# EasyEDA Pro project ProPrj_ESP32辉光钟_2025-08-24.epro, board PCB2_0
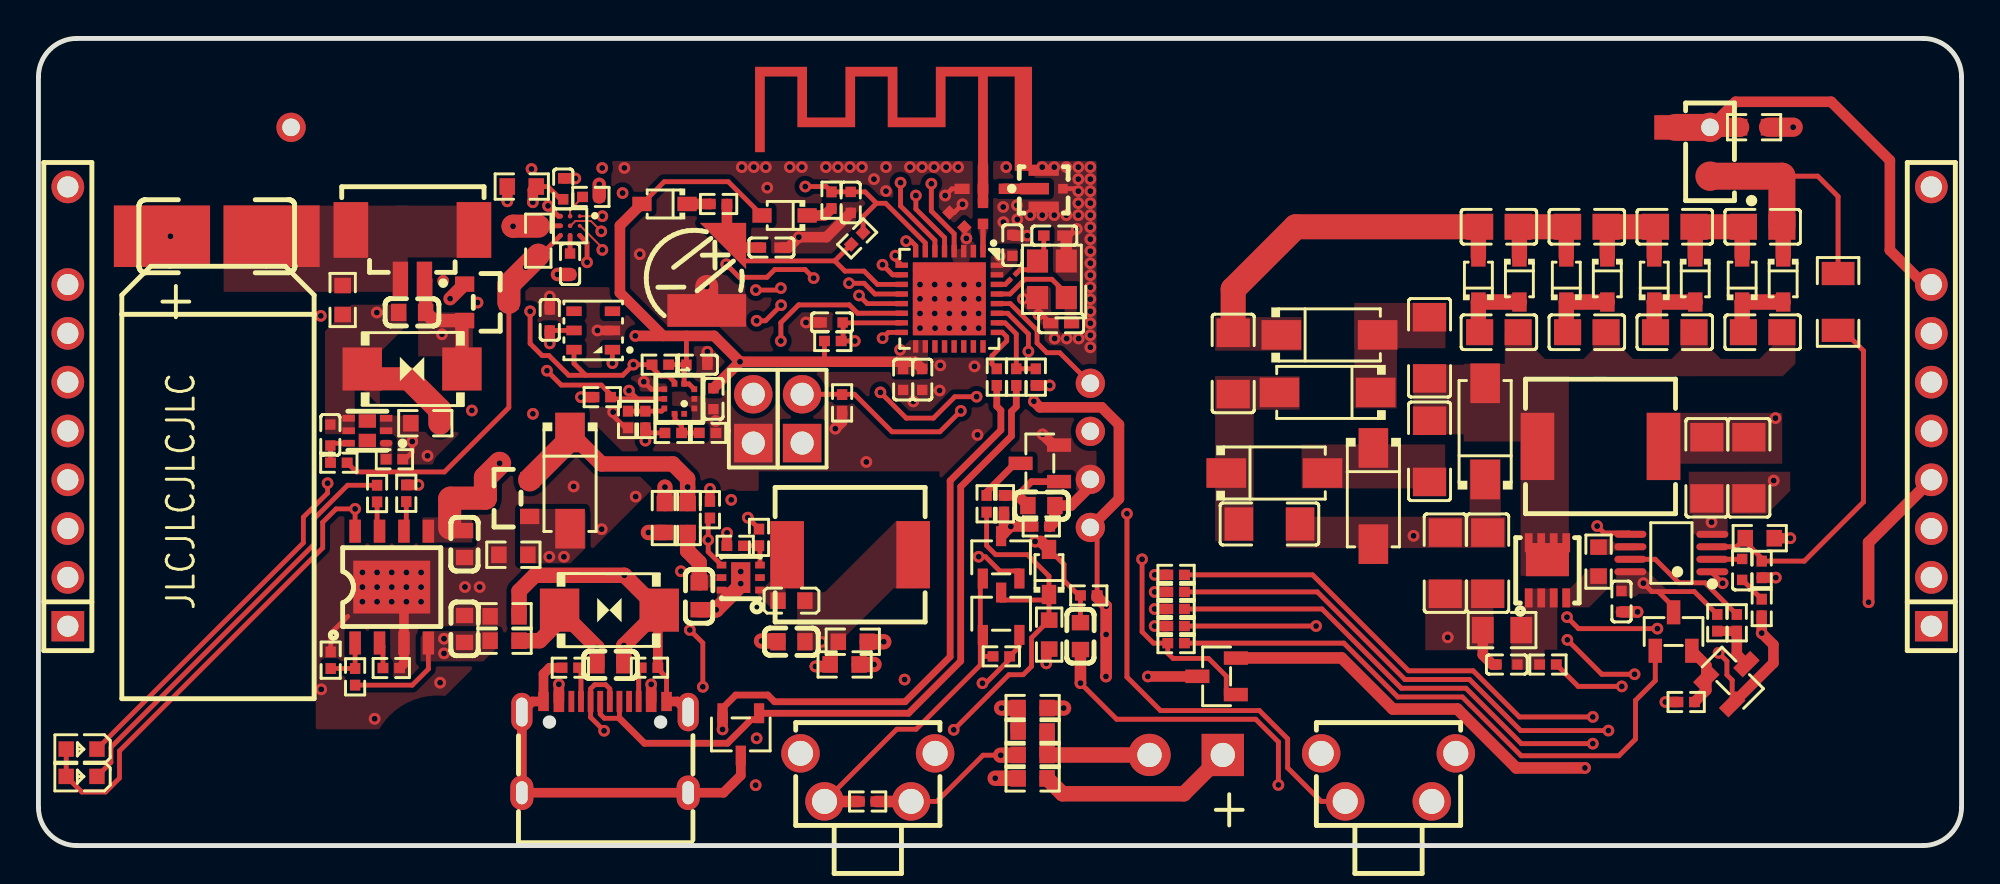
[diagram p6: board, top side]
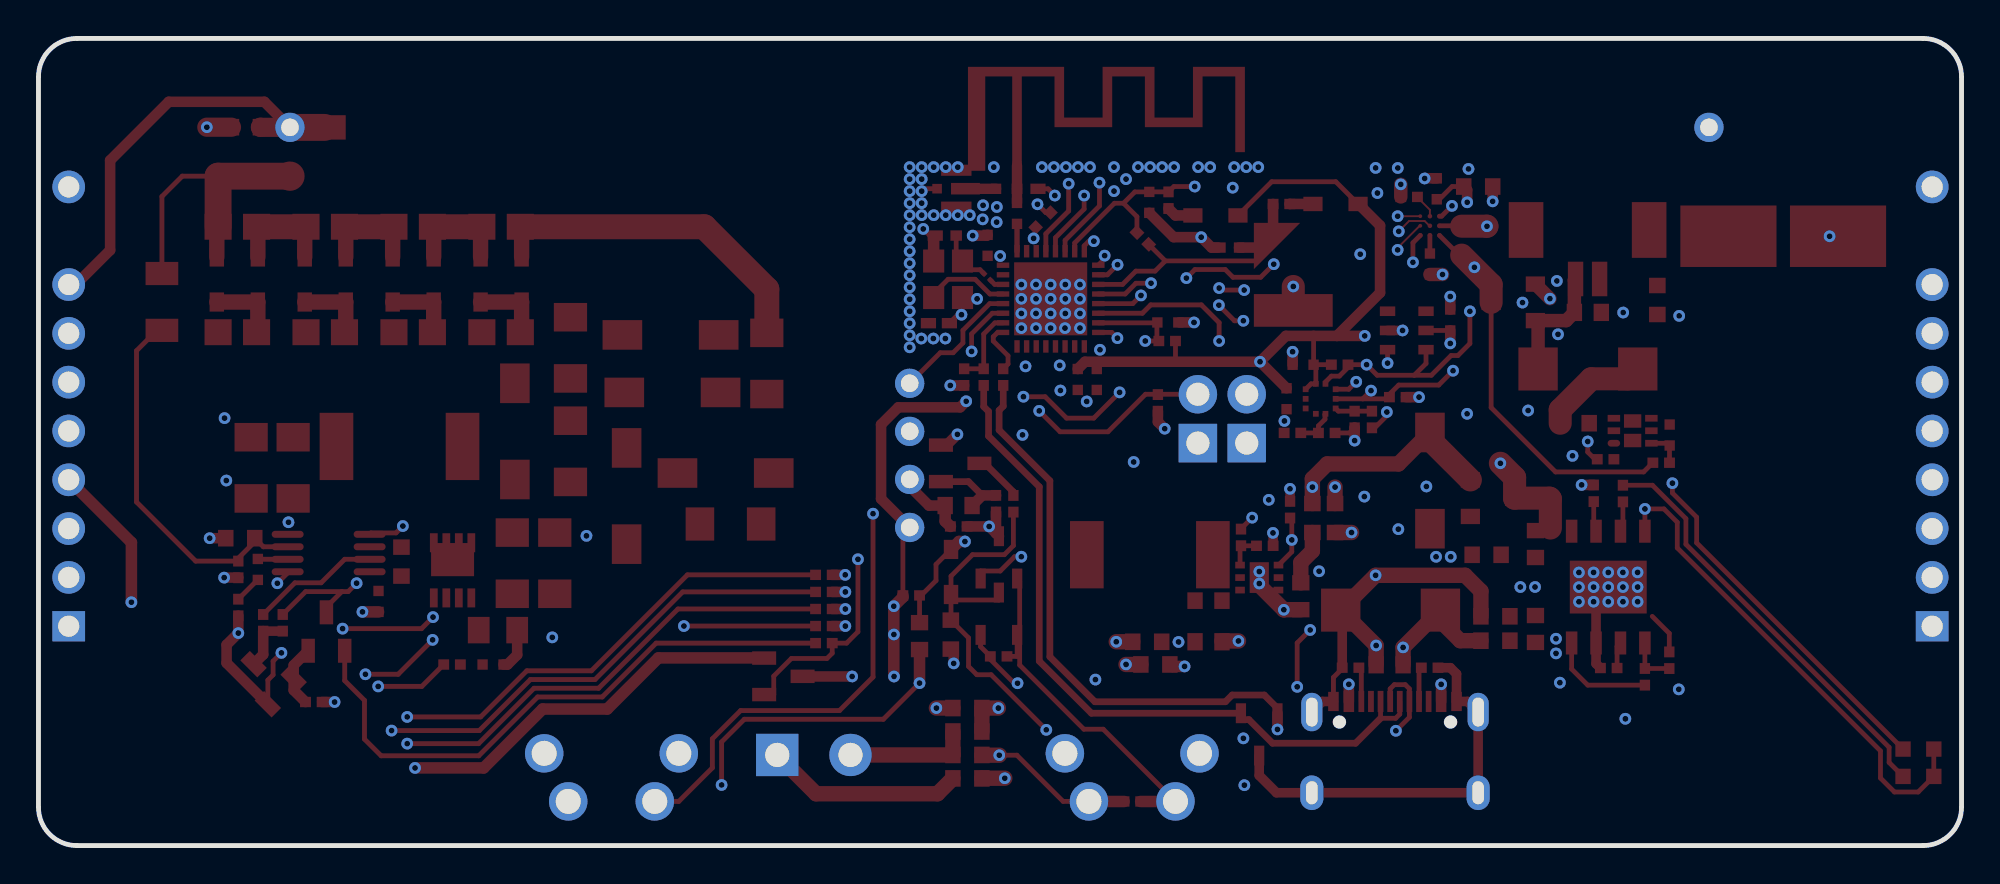
[diagram p7: board, bottom side, seen from below]

Outline 100 x 42 mm; copper layers: Top Layer, Inner1, Inner2, Bottom Layer. Coordinates in mm from the lower left corner of the outline.
Outline path: 0,40 0,2 arc(0.59,0.59) 2,0 98,0 arc(99.41,0.59) 100,2 100,40 arc(99.41,41.41) 98,42 2,42 arc(0.59,41.41) 0,40
Stack: Top Layer 0.035mm 外层铜厚1oz / Dielectric1 0.2104mm 7628 RC49% 8.6mil / Inner1 0.0152mm 内层铜厚 / Dielectric2 1.065mm 1.1mm H/HOZ Copper / Inner2 0.0152mm 内层铜厚 / Dielectric3 0.2104mm 7628 RC49% 8.6mil / Bottom Layer 0.035mm 外层铜厚1oz

## Design rules (mm)
template: 自定义配置1
spacing Default (default): track to track 0.2, other pairs 0 to 0.5
spacing dis+170v: track to track 1, other pairs 0 to 1.001
spacing dis+3v3: track to track 0.2, other pairs 0.152 to 0.3
spacing usbtypec: track to track 0.2, other pairs 0.152 to 0.3
spacing safeBGA: track to track 0.1, other pairs 0.1 to 0.3
track width Default (default): min 0.249, default 0.249, max 25.4
track width dis+170v: min 0.249, default 0.249, max 25.4
track width trackbga: min 0.1, default 0.254, max 2.54
differential pair differentialPair (default): width min 0.127, default 0.254, max 2.54; gap min 0.152, default 0.152
via Default (default): diameter min 0.61, default 0.61, max 100.025; hole min 0.305, default 0.305, max 59.995
via dis+170v: diameter min 0.61, default 0.61, max 100.025; hole min 0.305, default 0.305, max 59.995
net SDA uses safeBGA, trackbga
net GNDBADC uses safeBGA, trackbga
net BATALT uses safeBGA, trackbga
net $7N48606 uses trackbga

## Placement (name value [footprint] x y rotation side)
C1  10uF  [C0603]  19.43 27.74 0 top
C2  10uF  [C0603]  22.16 15.69 90 top
C3  10uF  [C0603]  22.16 11.27 270 top
C7  22nF  [C0402#2]  88.59 14.37 90 top
C13  4.7uF  [C1206]  72.34 20.52 270 top
C15  22uF  [C1206]  73.15 14.7 90 top
C16  4.7uF  [C1206]  64.01 16.73 180 top
C17  4.7uF  [C1206]  62.13 25.09 90 top
C18  4.7uF  [C1206]  72.34 25.9 90 top
C19  2.2uF  [C0805]  75.94 32.2 0 top
C20  2.2uF  [C0805]  75.94 26.71 180 top
C21  2.2uF  [C0805]  89.66 32.2 0 top
C22  2.2uF  [C0805]  89.66 26.71 180 top
C23  2.2uF  [C0805]  85.09 32.2 0 top
C24  2.2uF  [C0805]  85.09 26.71 180 top
C25  2.2uF  [C0805]  80.52 32.2 0 top
C26  2.2uF  [C0805]  80.52 26.71 180 top
C54  NULL  [C0402#3]  48.57 34.17 0 top
C56  10nF  [C0402#2]  42.24 33.47 90 top
C59  10uF  [C0402#2]  50.64 31.23 270 top
C61  10uF  [C0402#3]  38.11 31.12 180 top
C66  10uF  [C0402#2]  44.97 24.25 90 top
C68  10uF  [C0402#2]  47.76 32.56 315 top
C70  10uF  [C0402#2]  45.96 24.25 90 top
C71  10pF  [C0402]  52.82 31.74 180 top
C72  10pF  [C0402#4]  53.18 27.18 0 top
C73  10nF  [C0402#2]  41.27 27.22 0 top
C74  10uF  [C0603]  29.74 9.41 180 top
C75  10uF  [C0603]  54.18 10.9 90 top
C76  22uF  [C1206]  75.36 14.7 90 top
C77  22uF  [C1206]  88.94 19.66 90 top
C78  22uF  [C1206]  86.76 19.66 90 top
C82  100nF  [C0402#2]  76.36 9.42 0 top
C83  NULL  [C0402#2]  49.66 34.17 0 top
C84  1nF  [C2211]  9.27 31.71 180 top
C150  10uF  [C0603]  34.36 12.97 90 top
C151  10uF  [C0603]  39.16 10.6 0 top
C158  10uF  [C0402#2]  26.59 27.35 270 top
C160  10uF  [C0402#2]  34.24 25.02 180 top
C161  100nF  [C0402#2]  35.1 23.25 90 top
C163  10uF  [C0402#2]  82.32 12.7 90 top
C165  100nF  [C0402#2]  15.18 21.36 270 top
C166  100nF  [C0402#2]  27.64 30.26 90 top
C168  10uF  [C0603]  52.15 17.69 180 top
C169  2.2uF  [C0402#2]  27.29 34.18 90 top
CN2  DZ254S-11-02-48  [HDR-SMD_2P-P2.54_XKB_X6511WVS-02H-C60D48R2]  86.92 36.1 90 top
D1  P6SMB6.8CA/TR13  [SMB_L4.6-W3.6-LS5.3-BI]  19.43 24.8 0 top
D2  1N4148WS  [SOD-323_L1.8-W1.3-LS2.5-RD]  52.55 14.24 90 top
D16  PSM712-LF-T7  [SOT-23-3_L3.0-W1.7-P0.95-LS2.9-BR]  36.52 5.78 90 top
D17  P6SMB6.8CA/TR13  [SMB_L4.6-W3.6-LS5.3-BI]  29.69 12.25 180 top
D18  SS54  [SMA_L4.4-W2.8-LS5.4-R-RD]  69.42 18.19 270 top
D19  SS54  [SMA_L4.4-W2.8-LS5.4-R-RD]  64.27 19.39 0 top
D20  SS54  [SMA_L4.4-W2.8-LS5.4-R-RD]  67.13 26.57 0 top
D21  SS54  [SMA_L4.4-W2.8-LS5.4-R-RD]  67.03 23.58 180 top
D22  1N5819WS  [SOD-323_L1.8-W1.3-LS2.5-RD]  74.88 29.46 90 top
D23  1N5819WS  [SOD-323_L1.8-W1.3-LS2.5-RD]  88.59 29.46 90 top
D24  1N5819WS  [SOD-323_L1.8-W1.3-LS2.5-RD]  84.02 29.46 90 top
D25  1N5819WS  [SOD-323_L1.8-W1.3-LS2.5-RD]  79.45 29.46 90 top
D26  1N5819WS  [SOD-323_L1.8-W1.3-LS2.5-RD]  81.58 29.46 270 top
D27  1N5819WS  [SOD-323_L1.8-W1.3-LS2.5-RD]  86.15 29.46 270 top
D28  1N5819WS  [SOD-323_L1.8-W1.3-LS2.5-RD]  90.73 29.46 270 top
D29  1N5819WS  [SOD-323_L1.8-W1.3-LS2.5-RD]  77.01 29.46 270 top
D30  SS54  [SMA_L4.4-W2.8-LS5.4-R-RD]  75.23 21.55 90 top
D33  SS54  [SMA_L4.4-W2.8-LS5.4-R-RD]  27.64 18.99 270 top
D34  1N4148WS  [SOD-323_L1.8-W1.3-LS2.5-RD]  32.55 33.39 180 top
D35  1N4148WS  [SOD-323_L1.8-W1.3-LS2.5-RD]  38.8 32.79 180 top
F1  0Ω  [R0603]  15.82 28.39 270 top
FPC1  1.25-2PWB  [CONN-SMD_2P-P1.25_DEALON_1.25-2PWB]  19.45 30.76 180 top
H1  PZ254V-11-02P  [HDR-TH_2P-P2.54-V-M]  39.71 22.21 90 top
H2  PZ254V-11-02P  [HDR-TH_2P-P2.54-V-M]  37.17 22.21 90 top
J1  2.54-1*10P针  [HDR-TH_10P-P2.54-V-M-1]  98.43 22.84 90 top
J2  2.54-1*10P针  [HDR-TH_10P-P2.54-V-M-1]  1.53 22.84 90 top
KEY5  TS665ZJ  [SW-TH_TS665ZJ]  70.2 3.55 0 top
KEY7  TS665ZJ  [SW-TH_TS665ZJ]  43.13 3.55 0 top
L1  22uH  [IND-SMD_L7.8-W7.0_FXC0630]  42.21 15.13 0 top
L2  22uH  [IND-SMD_L7.8-W7.0_FXC0630]  81.23 20.77 180 top
L15  0R  [L0402]  49.12 32.9 270 top
L19  2.2uH  [L0603]  39.16 12.74 0 top
LED1  A-SP192GW1D-D01-4T  [LED0603-RD]  2.24 5.02 180 top
LED2  KT-0603R  [LED0603-RD]  2.24 3.6 180 top
NOREF  -  [Pad_e511]  54.7 21.55 270 top
NOREF#2  -  [Pad_e3337]  86.92 34.83 180 top
NOREF#3  -  [Pad_e3336]  86.92 37.37 270 top
NOREF#4  -  [Pad_e3335]  13.14 37.37 270 top
NOREF#5  -  [Pad_e24]  61.58 4.72 180 top
NOREF#6  -  [Pad_e534]  54.7 19.05 270 top
NOREF#7  -  [Pad_e510]  54.7 24.05 270 top
NOREF#8  -  [Pad_e1713]  54.7 16.55 270 top
NOREF#9  -  [Pad_e28]  57.77 4.72 180 top
Q1  SI2301CDS-T1-GE3  [SOT-23-3_L3.0-W1.7-P0.95-LS2.9-BR]  50.06 12.06 270 top
Q2  SI2301CDS-T1-GE3  [SOT-23-3_L3.0-W1.7-P0.95-LS2.9-BR]  50.06 15 270 top
Q9  SQ7414CENW-T1_GE3  [POWERPAK-1212-8_L3.3-W3.3-P0.65-BL-EP]  78.47 14.32 0 top
Q11  AO3401A  [SOT-23_L2.9-W1.3-P1.90-LS2.4-BR]  24.39 18.08 0 top
Q12  AO3401A  [SOT-23_L2.9-W1.3-P1.90-LS2.4-BR]  23.31 28.27 180 top
Q13  AO3400A  [SOT-23-3_L2.9-W1.3-P1.90-LS2.4-BR]  61.26 8.81 0 top
Q14  2N7002  [SOT-23-3_L2.9-W1.3-P1.90-LS2.4-BR]  85.03 11.14 270 top
Q15  AO3400A  [SOT-23-3_L2.9-W1.3-P1.90-LS2.4-BR]  88.11 8.73 225 top
Q16  2N7002  [SOT-23-3_L2.9-W1.3-P1.90-LS2.4-BR]  52.07 19.89 0 top
R2  5.1kΩ  [R0402]  27.66 9.26 0 top
R3  10kΩ  [R0402]  16.47 8.78 270 top
R4  10kΩ  [R0402]  15.2 9.64 270 top
R5  1kΩ  [R0402]  19.13 18.33 270 top
R6  1kΩ  [R0402]  17.61 18.32 270 top
R7  1kΩ  [R0402]  18.35 9.24 180 top
R14  100kΩ  [R0402]  50.07 9.84 0 top
R15  100kΩ  [R0402]  52.15 16.61 180 top
R16  10MΩ  [R0603]  52.56 10.98 90 top
R17  1MΩ  [R0402]  54.62 13.02 0 top
R18  0Ω  [R0603]  81.12 14.78 270 top
R19  51kΩ  [R0402]  88.31 11.59 90 top
R20  0Ω  [R0805]  76.11 11.21 0 top
R21  4.7kΩ  [R0402]  89.61 12.39 90 top
R23  1MΩ  [R1206]  93.58 28.29 90 top
R24  7.5kΩ  [R0603]  89.51 15.99 180 top
R25  NULL  [R0402]  89.61 14.37 270 top
R29  10kΩ  [R0402]  87.3 11.59 90 top
R40  0Ω  [R0402]  50.85 24.38 90 top
R41  0Ω  [R0402]  49.83 24.38 90 top
R42  100KΩ  [R0402]  51.86 24.38 90 top
R45  100KΩ  [R0402]  41.31 26.26 0 top
R56  5.1kΩ  [R0402]  31.77 9.26 180 top
R57  0Ω  [R0603]  51.7 5.94 180 top
R59  0Ω  [R0603]  51.7 4.72 0 top
R60  0Ω  [R0603]  32.58 17.04 270 top
R61  0Ω  [R0603]  24.24 11.93 180 top
R63  0Ω  [R0402]  78.49 9.42 0 top
R128  200kΩ  [R0402]  37.47 16.03 270 top
R129  100kΩ  [R0402]  36.23 15.6 180 top
R145  10kΩ  [R0603]  24.7 15.13 180 top
R146  0Ω  [R0603]  33.76 17.04 270 top
R147  0Ω  [R0603]  24.24 10.66 180 top
R148  0Ω  [R0603]  51.7 3.5 0 top
R149  100KΩ  [R0402]  41.24 33.58 90 top
R151  0Ω  [R0603]  51.7 7.16 180 top
R152  0Ω  [R0603]  89.21 37.38 180 top
R153  0Ω  [R0402]  59.16 12.31 180 top
R154  0Ω  [R0402]  59.16 13.2 180 top
R155  0Ω  [R0402]  59.16 14.09 180 top
R157  100KΩ  [R0402]  41.79 23.04 270 top
R159  0Ω  [R0201]  50.67 29.59 45 top
R160  0Ω  [R0603]  41.92 9.42 0 top
R161  0Ω  [R0603]  42.34 10.6 0 top
R164  2kΩ  [R0402]  29.32 23.33 180 top
R165  2kΩ  [R0402]  32.34 25.02 180 top
R169  NULL  [R0402]  33.01 21.47 0 top
R170  NULL  [R0402]  34.79 21.47 0 top
R171  NULL  [R0402]  31.56 22.17 90 top
R172  1kΩ  [R0402]  30.66 22.17 270 top
R173  0Ω  [R0402]  59.16 11.42 180 top
R174  0Ω  [R0402]  59.16 10.53 0 top
R176  NULL  [R0402]  43.12 2.29 0 top
R178  470Ω  [R0402]  15.62 19.92 180 top
R179  2kΩ  [R0402]  18.51 20.1 180 top
R181  0Ω  [R0402]  34.92 17.48 270 top
R182  0Ω  [R0603]  20.12 21.98 180 top
R183  10kΩ  [R0402]  28.73 33.75 180 top
R184  10mΩ  [R0603]  25.99 31.48 90 top
R186  0Ω  [R0402]  49.3 17.79 270 top
R187  1MΩ  [R0402]  50.21 17.79 270 top
R188  100kΩ  [R0402]  85.68 7.47 0 top
R189  0Ω  [R0603]  25.13 34.29 0 top
R190  1kΩ  [R0402]  35.37 33.39 0 top
R191  100KΩ  [R0402]  42.57 31.59 225 top
RF2  BWIPX-4-001E  [IPEX-SMD_BWIPX-4-001E]  52.53 34.18 270 top
S1  AHT20  [SENSOR-SMD_L3.0-W3.0-P1.00-BR]  28.85 26.8 0 top
U2  TP4056-42-ESOP8  [ESOP-8_L4.9-W3.9-P1.27-LS6.0-BL-EP]  18.37 13.45 0 top
U5  LM3478MMX/NOPB  [VSSOP-8_L3.0-W3.0-P0.65-LS5.0-BL]  84.91 15.22 90 top
U16  ESP32-C3FH4  [QFN-32_L5.0-W5.0-P0.50-TL-EP3.7]  47.37 28.45 270 top
U17  ML414H-IV01E  [BAT-SMD_ML414H-IV01E]  35.17 29.82 0 top
U22  -  [2.4G天线]  51.67 35.12 0 top
U23  BMP580  [LGA-10_L2.0-W2.0-P0.50-TL_BMP580]  33.33 23.25 270 top
U46  ETA3425D2G  [TDFN-6_L2.0-W2.0-P0.65-TL-EP]  36.52 13.94 180 top
U47  SL197-1  [DFN-6L_L2.0-W2.0-P0.65-BL_SL197-1]  17.1 21.59 90 top
U48  BQ27220YZFR  [DSBGA-9_L1.7-W1.6-R3-C3-P0.50-BL]  27.65 32.25 180 top
USB1  TYPE-C 16PIN 2MD(073)  [USB-C-SMD_TYPE-C-6PIN-2MD-073]  29.46 5.12 0 top
X4  40MHz  [CRYSTAL-SMD_4P-L2.5-W2.0-BL]  52.7 29.47 90 top

## Footprints (pads in the part's own frame, mm; a bottom-side part is the same pattern mirrored in y, then rotated)
2.4G天线
  rect 0.85x0.5 smd: 1(-0.447,0.254)
  rect 0.45x0.5 smd: 2(-2.55,0.254)
BAT-SMD_ML414H-IV01E
  custom 2.4x2.41 smd: 1(0.425,1.975)
  rect 4.1x1.7 smd: 2(-0.425,-1.975)
C0402
  rect 0.79x0.54 smd: 1(-0.545,0)
  rect 0.6x0.54 smd: 2(0.545,0)
C0402#2
  rect 0.54x0.54 smd: 1(-0.545,0) 2(0.545,0)
C0402#3
  rect 0.79x0.54 smd: 1(-0.545,0)
  rect 0.54x0.54 smd: 2(0.545,0)
C0402#4
  rect 0.79x0.54 smd: 1(-0.545,0) 2(0.545,0)
C0603
  rect 0.8x0.9 smd: 1(-0.7,0) 2(0.7,0)
C0805
  rect 1.41x1.35 smd: 1(-1,0) 2(1,0)
C1206
  rect 1.485x1.728 smd: 1(-1.593,0) 2(1.593,0)
C2211
  rect 5x3.2 smd: 1(2.85,0) 2(-2.85,0)
CONN-SMD_2P-P1.25_DEALON_1.25-2PWB
  rect 0.8x1.8 smd: 1(-0.625,1.275) 2(0.625,1.275)
  rect 1.8x2.9 smd: 3(-3.2,-1.275) 4(3.2,-1.275)
CRYSTAL-SMD_4P-L2.5-W2.0-BL
  rect 1.2x1.1 smd: 1(-0.95,-0.75) 2(0.95,-0.75) 3(0.95,0.75) 4(-0.95,0.75)
DFN-6L_L2.0-W2.0-P0.65-BL_SL197-1
  oval 0.35x0.65 smd: 1(-0.65,-0.975)
  rect 0.35x0.65 smd: 2(0,-0.975) 3(0.65,-0.975) 4(0.65,0.975) 5(0,0.975) 6(-0.65,0.975)
  rect 0.7x0.9 smd: 7(-0.508,0) 8(0.508,0)
DSBGA-9_L1.7-W1.6-R3-C3-P0.50-BL
  round 0.2 smd: A1(-0.5,-0.5) A2(-0.5,0)
  round 0.24 smd: A3(-0.5,0.5) B1(0,-0.5) B2(0,0) B3(0,0.5) C1(0.5,-0.5) C2(0.5,0) C3(0.5,0.5)
ESOP-8_L4.9-W3.9-P1.27-LS6.0-BL-EP
  rect 0.6x1.2 smd: 1(-1.905,-2.909) 2(-0.635,-2.909) 3(0.635,-2.909) 4(1.905,-2.909) 5(1.905,2.909) 6(0.635,2.909) 7(-0.635,2.909) 8(-1.905,2.909)
  rect 4x2.75 smd: 9(0,0)
HDR-SMD_2P-P2.54_XKB_X6511WVS-02H-C60D48R2
  rect 1.27x2.2 smd: 1(-1.27,-1.8) 2(1.27,1.8)
HDR-TH_2P-P2.54-V-M
  rect 2x2 hole 1.2: 1(-1.27,0)
  round 2 hole 1.2: 2(1.27,0)
HDR-TH_10P-P2.54-V-M-1
  rect 1.575x1.7 hole 1.1: 1(-11.43,0)
  round 1.7 hole 1.1: 2(-8.89,0) 3(-6.35,0) 4(-3.81,0) 5(-1.27,0) 6(1.27,0) 7(3.81,0) 8(6.35,0) 10(11.43,0)
  round 0.003 hole 1.1: 9(8.89,0)
IND-SMD_L7.8-W7.0_FXC0630
  rect 1.75x3.5 smd: 1(-3.277,0) 2(3.277,0)
IPEX-SMD_BWIPX-4-001E
  rect 0.6x1.5 smd: 1(0,-0.738)
  rect 0.58x1.58 smd: 2(0.96,-0.263) 3(-0.96,-0.263)
  rect 0.5x0.5 smd: 4(0,0.738)
L0402
  rect 0.54x0.54 smd: 1(-0.545,0) 2(0.545,0)
L0603
  rect 0.8x0.864 smd: 1(-0.7,0) 2(0.7,0)
LED0603-RD
  rect 0.8x0.8 smd: 1(-0.799,0) 2(0.799,0)
LGA-10_L2.0-W2.0-P0.50-TL_BMP580
  rect 0.3x0.3 smd: 1(-0.78,0.25) 2(-0.78,-0.25) 3(-0.5,-0.78) 4(0,-0.78) 5(0.5,-0.78) 6(0.78,-0.25) 7(0.78,0.25) 8(0.5,0.78) 9(0,0.78) 10(-0.5,0.78)
Pad_e24
  rect 2.2x2.2 hole 1.26: 1(0,0)
Pad_e28
  round 2.2 hole 1.26: 2(0,0)
Pad_e510
  round 1.524 hole 0.914: 1(0,0)
Pad_e511
  round 1.524 hole 0.914: 1(0,0)
Pad_e534
  round 1.524 hole 0.914: 1(0,0)
Pad_e1713
  round 1.524 hole 0.914: 1(0,0)
Pad_e3335
  round 1.524 hole 0.914: 1(0,0)
Pad_e3336
  round 1.524 hole 0.914: 1(0,0)
Pad_e3337
  round 1.524 smd: 1(0,0)
POWERPAK-1212-8_L3.3-W3.3-P0.65-BL-EP
  rect 0.405x0.99 smd: 1(-0.975,-1.435) 2(-0.325,-1.435) 3(0.325,-1.435) 4(0.975,-1.435) 5(0.975,1.435) 6(0.325,1.435) 7(-0.325,1.435) 8(-0.975,1.435)
  rect 2.235x1.725 smd: 9(0,0.557)
QFN-32_L5.0-W5.0-P0.50-TL-EP3.7
  rect 0.65x0.28 smd: 1(-2.478,1.75) 2(-2.478,1.25) 3(-2.478,0.75) 4(-2.478,0.25) 5(-2.478,-0.25) 6(-2.478,-0.75) 7(-2.478,-1.25) 8(-2.478,-1.75) 17(2.478,-1.75) 18(2.478,-1.25) 19(2.478,-0.75) 20(2.478,-0.25) 21(2.478,0.25) 22(2.478,0.75) 23(2.478,1.25) 24(2.478,1.75)
  rect 0.28x0.65 smd: 9(-1.75,-2.478) 10(-1.25,-2.478) 11(-0.75,-2.478) 12(-0.25,-2.478) 13(0.25,-2.478) 14(0.75,-2.478) 15(1.25,-2.478) 16(1.75,-2.478) 25(1.75,2.478) 26(1.25,2.478) 27(0.75,2.478) 28(0.25,2.478) 29(-0.25,2.478) 30(-0.75,2.478) 31(-1.25,2.478) 32(-1.75,2.478)
  rect 3.8x3.8 smd: 33(0,0)
R0201
  rect 0.28x0.25 smd: 1(-0.241,0) 2(0.241,0)
R0402
  rect 0.566x0.54 smd: 1(-0.433,0) 2(0.433,0)
R0603
  rect 0.806x0.864 smd: 1(-0.753,0) 2(0.753,0)
R0805
  rect 1.133x1.377 smd: 1(-1,0) 2(1,0)
R1206
  rect 1.208x1.701 smd: 1(-1.479,0) 2(1.479,0)
SENSOR-SMD_L3.0-W3.0-P1.00-BR
  rect 0.8x0.5 smd: 1(1,-1) 2(1,0) 3(1,1) 4(-1,1) 5(-1,0) 6(-1,-1)
SMA_L4.4-W2.8-LS5.4-R-RD
  rect 2.062x1.539 smd: 1(2.503,0) 2(-2.503,0)
SMB_L4.6-W3.6-LS5.3-BI
  rect 2.047x2.241 smd: 1(-2.591,0) 2(2.591,0)
SOD-323_L1.8-W1.3-LS2.5-RD
  rect 1x0.75 smd: 1(-1.173,0) 2(1.173,0)
SOT-23-3_L2.9-W1.3-P1.90-LS2.4-BR
  rect 1.25x0.7 smd: 1(1,-0.95) 2(1,0.95) 3(-1,0)
SOT-23-3_L3.0-W1.7-P0.95-LS2.9-BR
  rect 1.038x0.532 smd: 1(1.101,-0.95) 2(1.101,0.95) 3(-1.101,0)
SOT-23_L2.9-W1.3-P1.90-LS2.4-BR
  rect 1x0.8 smd: 1(1.15,-0.95) 2(1.15,0.95) 3(-1.15,0)
SW-TH_TS665ZJ
  round 2 hole 1.3: 1(2.25,-1.25) 2(-2.25,-1.25) 3(3.5,1.25) 4(-3.5,1.25)
TDFN-6_L2.0-W2.0-P0.65-TL-EP
  rect 0.5x0.35 smd: 1(-1,0.65) 2(-1,0) 3(-1,-0.65) 4(1,-0.65) 5(1,0) 6(1,0.65)
  rect 1x1.6 smd: 7(0,0)
USB-C-SMD_TYPE-C-6PIN-2MD-073
  rect 0.55x1 smd: 1(-3.2,2.375) 12(3.2,2.375)
  rect 0.55x1.1 smd: 2(-2.4,2.375) 11(2.4,2.375)
  rect 0.3x1.1 smd: 3(-1.75,2.375) 4(-1.25,2.375) 5(-0.75,2.375) 6(-0.25,2.375) 7(0.25,2.375) 8(0.75,2.375) 9(1.25,2.375) 10(1.75,2.375)
  oval 1.1x2 hole 0.6x1.5: 13(-4.325,1.825) 14(4.325,1.825)
  oval 1.2x1.8 hole 0.6x1.2: 13(-4.325,-2.375) 14(4.325,-2.375)
VSSOP-8_L3.0-W3.0-P0.65-LS5.0-BL
  oval 0.364x1.662 smd: 1(-0.975,-2.131) 2(-0.325,-2.131) 3(0.325,-2.131) 4(0.975,-2.131) 5(0.975,2.131) 6(0.325,2.131) 7(-0.325,2.131) 8(-0.975,2.131)

## Nets
As in the schematic, except:
DGND: C54.1 C56.1 C59.1 C61.1 C66.1 C68.1 C70.1 C71.1 C72.1 C73.1 C74.1 C75.1 C158.1 C160.1 C161.1 C168.1 D16.3 D17.1 H2.1 KEY5.1 NOREF#6.1 Q16.2 R2.1 R15.1 R56.1 R57.2 R61.1 R151.2 R157.2 R160.2 R170.2 R172.2 RF2.2 RF2.3 RF2.4 S1.2 U16.33 U17.2 U22.1 U23.3 U23.8 U23.9 USB1.1 USB1.12 USB1.13 USB1.14 X4.2 X4.4
PGND: C15.1 C76.1 C77.1 C78.1 C82.1 C163.1 NOREF#9.2 Q15.2 R20.1 R21.1 R24.1 R57.1 R59.2 R152.1 R188.1 U5.4 U5.5
VCC+170V: C21.2 CN2.1 D28.1 NOREF#2.1 R23.2
VCCBOOST+5V: C77.2 C78.2 L2.1 NOREF#5.1 R148.2
VCCMCU+3V3: C59.2 C66.2 C68.2 C70.2 C158.2 C160.2 C161.2 D34.2 D35.2 H1.1 NOREF#8.1 Q2.2 Q13.3 R17.2 R42.1 R45.1 R161.2 R164.2 R165.1 R169.1 R171.1 S1.5 U16.2 U16.3 U16.17 U16.18 U16.31 U16.32 U23.1 U23.10
LPGND: CN2.2 J1.5 J1.6 J1.7 J1.8 J2.5 J2.6 J2.7 J2.8 NOREF#3.1 NOREF#4.1 R151.1 R152.2
$7N6501: NOREF#7.1 U16.28
$7N6504: NOREF.1 U16.27

Pads without a net: J1 9 10; J2 1 2 3 4 9 10; KEY5 3 4; KEY7 3 4; S1 3 4; U23 7; U46 2; U47 7 8; USB1 3 9

## Via types
v1: diameter 0.61, hole 0.31, Top Layer to Bottom Layer, 201 vias
v2: diameter 0.61, hole 0.305, Top Layer to Bottom Layer, 69 vias

## Routing (per net, layer and track width the routed paths; a pad name or vN(x,y) marks a point on that pad's centre or on a via; arc(x,y) is an arc through that point)
DGND: length 238.8
  Top Layer w0.249: C54.1 47.5,34.17 v1(47.15,33.83) ; v1(48.05,33.37) 47.62,32.94 C68.1
  Top Layer w0.25: 30.66,21.74 30.51,21.74 29.88,22.37 v1(29.88,22.56) ; 32.55,23.75 31.87,23.75 v2(31.48,24.13)
  Top Layer w0.254: USB1.12 32.66,8.75 32.21,9.2 ; C71.1 53.65,31.74 v1(53.99,32.09) ; v2(64.48,3.15) 64.48,5.39 63.3,6.57 56.07,6.57 v2(54.18,8.45) ; v1(54.07,34.05) 53.94,34.18 RF2.4 ; C72.1 52.19,27.62 v1(52,27.62) 52,28.46 X4.4
  Top Layer w0.5: D16.3 36.52,3.65 35.62,2.75 USB1.14 USB1.13 USB1.13 25.69,7.5 USB1.1 26.26,8.93 26.58,9.26 R2.1 ; S1.2 v1(29.07,26.8) ; 32.21,11.77 R56.1 ; USB1.14 33.24,7.5 USB1.12
  Top Layer w0.55: v2(41.44,21.69) 41.79,22.05 R157.2 ; 40.66,27.22 v1(39.91,27.22) ; NOREF#6.1 54.7,18.7 53.69,17.69 C168.1 ; v1(51.42,31.74) 50.69,31.74 C59.1 ; C158.1 v1(26.59,28.57) ; C56.1 40.97,31.66 v1(39.54,31.66) 39,31.12 C61.1 ; C160.1 v1(34.78,25.7) ; Q16.2 52.78,20.84 v2(52.22,21.4)
  Top Layer w0.6: X4.2 53.45,31.66 ; C75.1 v2(54.18,8.45) ; C168.1 52.85,16.88 R15.1
  Top Layer w0.8: C74.1 v1(30.44,10.41) 31.8,11.77 32.21,11.77 ; R57.2 R151.2 v1(50.09,7.16) ; D17.1 v1(30.47,14.06) 25.81,14.06 24.99,13.24 R61.1 ; R160.2 v1(43.45,9.42)
  Top Layer w1.2: U17.2 v1(34.75,29.09)
  Inner1 w0.55: 49.04,33.37 49.11,33.31 49.14,33.31 51.19,35.36 ; 49.04,33.37 v1(48.05,33.37) ; 49.04,33.37 48.59,33.83 v1(47.15,33.83) ; v1(43.45,9.42) 46.21,9.42 47.71,10.92
  Inner1 w0.6: 42.18,24.55 41.44,23.81 v2(41.44,21.69) ; v2(52.22,21.4) 52.22,19.65 ; v2(54.18,8.45) 51.38,8.45 v1(50.09,7.16)
  Inner1 w0.7: 33.22,24.13 31.65,22.56 v1(29.88,22.56) ; 33.22,24.13 34.13,25.04 ; 33.22,24.13 v2(31.48,24.13) ; 34.13,25.04 v1(34.78,25.7) 35.47,26.38 ; 34.13,25.04 34.13,23.18 v1(35.21,22.09) ; 45.84,25.51 44.89,24.55 42.18,24.55 41.33,25.4 37.63,25.4 36.65,26.38 35.47,26.38 ; 45.84,25.51 v1(45.84,26.93) ; 45.84,25.51 45.84,23.46 v1(45.49,23.11) ; v1(39.91,27.22) 40.38,27.69 v1(45.84,27.69) ; 35.47,26.38 32.54,26.38 31.45,27.47 29.73,27.47 v1(29.07,26.8) 28.35,26.8 v1(26.59,28.57) ; 35.47,26.38 34.75,27.11 v1(34.75,29.09) ; v1(45.84,29.19) 43.66,29.19 41.2,31.66 v1(39.54,31.66) ; 48.89,28.45 v1(51.19,28.45) 51.42,28.68 v1(51.42,31.74) ; v1(48.89,29.19) 49.11,29.41 49.11,33.31 ; v1(47.37,29.19) 47.37,32.69 v1(48.05,33.37)
  Inner1 w1.2: 45.12,7.16 47.71,9.75 47.71,20.89 v1(45.49,23.11) ; 45.12,7.16 v1(50.09,7.16) ; 45.12,7.16 33.99,7.16 USB1.14 ; v1(48.89,26.93) 49.88,26.93 50.35,26.46 50.35,21.52 52.81,19.05 NOREF#6.1
  Inner2 w0.254: v2(64.48,3.15) 66.66,0.97 71.13,0.97 KEY5.1
  Inner2 w0.6: H2.1 36.02,22.09 v1(35.21,22.09)
  Inner2 w0.8: USB1.13 25.75,6.95 26.18,7.38 32.74,7.38 33.17,6.95 USB1.14
  vias: v1(36.57,35.3) v1(37.2,35.3) v1(37.34,5.58) v1(37.29,3.14) v1(37.82,35.3) v1(37.9,34.23) v1(39.07,35.3) v1(39.7,35.3) v1(40.95,35.3) v1(41.57,35.3) v1(42.2,35.3) v1(42.82,35.3) v1(43.05,19.96) v1(43.45,34.68) v1(44.07,35.3) v1(44.07,34.05) v1(45.32,35.3) v1(45.84,28.45) v1(45.95,35.3) v1(46.57,35.3) v1(46.6,29.19) v1(46.6,28.45) v1(46.6,27.69) v1(46.62,26.93) v1(46.9,24.99) v1(47.2,35.3) v1(47.37,28.45) v1(47.37,27.69) v1(47.37,26.93) v1(47.82,35.3) v1(48.13,29.19) v1(48.13,28.45) v1(48.13,27.69) v1(48.13,26.93) v1(48.67,24.94) v1(48.83,21.37) v1(48.89,28.45) v1(48.89,27.69) v1(50.17,33.23) v1(50.17,32.44) v1(50.32,35.3) v1(50.88,33.32) v1(50.9,32.59) v1(51.57,32.8) v1(52.2,35.3) v1(52.2,32.8) v1(52.82,35.3) v1(52.82,32.8) v1(52.84,26.38) v1(53.45,35.3) v1(53.45,32.8) v1(53.47,26.38) v1(54.07,35.3) v1(54.07,34.68) v1(54.07,33.43) v1(54.07,32.8) v1(54.09,26.38) v1(54.7,35.3) v1(54.7,34.68) v1(54.7,34.05) v1(54.7,33.43) v1(54.7,32.8) v1(54.7,32.18) v1(54.7,31.55) v1(54.7,30.93) v1(54.7,30.3) v1(54.7,29.68) v1(54.7,29.05) v1(54.7,28.43) v1(54.7,27.8) v1(54.7,27.18) v1(54.7,26.55) v1(54.7,25.93) v2(30.47,35.26) v2(31.27,30.77) v2(46.86,23.68)
GNDBADC: length 17.8
  Top Layer w0.1: U48.B2 27.67,32.25 27.92,32.5 28.73,32.5 v2(29.27,31.96)
  Top Layer w0.249: R189.2 26.49,34.29 27.15,33.63 C169.1
  Top Layer w0.55: v2(25.71,33.47) 25.71,34.12 R189.2
  Top Layer w0.7: C166.1 v2(26.99,29.72) ; R183.1 v2(29.16,34.41)
  Inner1 w0.55: 27.39,31.96 29.16,33.73 v2(29.16,34.41) ; 27.39,31.96 v2(29.27,31.96) ; 27.39,31.96 26.72,31.96 25.72,32.96 25.72,33.47 v2(25.71,33.47) 25.71,31 v2(26.99,29.72)
  vias: v2(25.64,35.21) v2(29.32,35.26)
GNDBAT: length 98.1
  Top Layer w0.249: 15.2,10.08 15.2,11.04 16.08,11.93 ; R179.1 19.06,20.1 19.44,20.48 v1(19.44,21.03)
  Top Layer w0.25: KEY7.1 46.72,2.3 49.12,4.7 v2(50.04,4.7)
  Top Layer w0.5: v1(18.37,13.45) 19.01,12.82 U2.3 19.01,9.47 R7.1
  Top Layer w0.55: v2(52.41,9.48) 52.41,10.07 R16.1 ; R189.1 24.38,33.53 v2(24.38,33.52)
  Top Layer w0.6: KEY7.1 45.37,2.29 43.55,2.29
  Top Layer w0.8: v2(50.04,4.7) 50.93,4.7 R59.1 ; R60.1 v1(32.58,18.65)
  Inner1 w0.6: v2(27.83,18.69) 33.07,13.45 33.07,10.88 35.69,8.26 44.65,8.26 v1(45.04,8.64)
  Inner1 w1.2: v1(32.58,18.65) 32.55,18.69 v2(27.83,18.69) 24.84,21.67 20.08,21.67 v1(19.44,21.03) 17.93,19.52 17.93,14.98 19.46,13.45 20.66,13.45 20.66,13.45 v1(22.18,13.45) 22.94,13.45
  Inner2 w0.6: v2(50.04,4.7) 49.28,5.46 49.28,7.49 51.27,9.48 51.42,9.48 ; v1(45.04,8.64) 47.81,8.64 49.25,10.08 50.82,10.08 51.42,9.48 ; 51.42,9.48 v2(52.41,9.48)
  Inner2 w0.7: v1(19.44,21.03) 22.83,24.42 v2(22.83,28.26) 22.83,32.46 23.89,33.52 v2(24.38,33.52)
  vias: v1(14.7,8.13) v1(16.85,14.21) v1(16.84,13.45) v1(16.84,12.69) v1(17.48,6.6) v1(17.61,14.21) v1(17.61,13.45) v1(17.61,12.69) v1(18.37,14.21) v1(18.37,12.69) v1(19.13,14.21) v1(19.13,13.45) v1(19.13,12.69) v1(19.9,14.21) v1(19.9,13.45) v1(19.9,12.69) v1(20.89,8.48) v1(22.94,13.45) v1(29.29,16.46) v1(31.06,18.16) v2(14.68,27.56) v2(20.23,20.28) v2(21.04,29.38) v2(22.54,22.64) v2(25.71,22.47)
PGND: length 116
  Top Layer w0.25: v2(87.37,10.03) 87.8,9.6 87.8,8.88 88.07,8.61 Q15.2 ; U5.5 82.71,16.27 81.41,16.27 v1(81.05,16.63)
  Top Layer w0.55: Q15.2 90.22,9.5 90.22,10.45 v1(89.61,11.06) 89.61,11.96 ; v1(84.6,7.47) R188.1 ; R24.1 v1(91.1,15.99) ; 75.82,9.42 75.61,9.42 75.11,9.92 R20.1
  Top Layer w0.6: C163.1 v1(83.15,12.16)
  Top Layer w0.8: R57.1 R59.2 NOREF#9.2 57.82,4.76
  Top Layer w1: v1(91.24,37.38) R152.1
  Inner1 w0.5: v1(83.15,12.16) 82.38,12.93 82.38,14.85 84.15,16.63 ; v1(89.61,11.06) 91.71,13.16 91.71,15.39 v1(91.1,15.99)
  Inner1 w1: v1(91.1,15.99) 90.47,16.63 v1(81.05,16.63)
  Inner2 w0.6: v1(91.1,15.99) 94.9,15.99 96.27,17.37 96.27,35.55 94.44,37.38 v1(91.24,37.38)
  Inner2 w1.2: 57.82,4.76 61.57,8.51 78.99,8.51 80.65,10.17 80.65,14.39 86.01,19.75 89.47,19.75 v1(90.23,18.99)
  vias: v1(73.28,10.83) v1(87,16.82)
VCC+170V: length 15.3
  Top Layer w0.254: R23.2 93.58,33.77 92.52,34.83 90.66,34.83
  Top Layer w0.8: C21.2 90.73,32.13 D28.1
  Top Layer w1.4: NOREF#2.1 90.66,34.83 C21.2
VCCBAT+4V2: length 20.6
  Top Layer w0.249: R184.2 26.01,32.25 U48.C2
  Top Layer w1.2: R184.2 24.68,32.23 v2(24.68,32.23) ; 21.38,16.52 21.38,18.04 21.42,18.08 23.24,18.08 23.24,19.15 v2(23.98,19.89)
  Inner2 w1.2: v2(23.98,19.89) 23.98,31.53 v2(24.68,32.23)
VCCBOOST+5V: length 53.8
  Top Layer w0.8: 61.63,4.76 59.56,2.7 53.25,2.7 R148.2
  Inner2 w1.2: 61.63,4.76 63.98,7.11 79.57,7.11 82.05,9.59 82.05,13.81 86.59,18.35 88.48,18.35 89.31,17.53 91,17.53 91.78,18.3 91.78,20.79 v1(90.32,22.24)
VCCBOOSTCTR+5V: length 36.8
  Top Layer w0.25: v1(83.46,13.65) 83.89,13.22 84.22,13.22 ; 84.22,13.22 85.03,12.42 Q14.3 ; 84.22,13.22 86.11,13.22 R29.2
  Top Layer w0.254: 59.59,11.42 v2(66.44,11.42) ; v2(83,8.91) 81.29,8.91 v2(79.5,10.7)
  Inner2 w0.254: v2(79.5,10.7) 78.24,9.44 71.73,9.44 69.75,11.42 v2(66.44,11.42) ; v2(83,8.91) 83,10.99 83.96,11.95 83.96,13.15 v1(83.46,13.65)
VCCBUCK: length 2.9
  Top Layer w0.8: C150.2 34.36,14.73 33.76,15.33 R146.2
VCCL+3V3: length 46.7
  Top Layer w0.6: v2(80.42,4.04) 76.85,4.04 73.78,7.11 70.42,7.11 67.76,9.76 62.18,9.76 ; v2(95.17,12.66) 95.17,15.77 J1.4
  Inner2 w0.6: v2(80.42,4.04) 85.66,4.04 94.28,12.66 v2(95.17,12.66)
VCCMCU+3V3: length 136.1
  Top Layer w0.249: D35.2 35.87,34.54 32.54,34.54 D34.2
  Top Layer w0.25: R169.1 31.83,21.47 31.56,21.74 ; R45.1 40.87,25.44 ; C160.2 33.58,24.9 U23.1 33.83,24.03 U23.10 ; C160.2 33.69,26.52 ; C160.2 33.69,25.02 R165.1 ; 55.05,13.02 55.05,16.2 NOREF#8.1 ; Q2.2 51.01,14.29 49.99,14.29 49.24,15.03 v2(48.89,15.03) ; S1.5 C158.2
  Top Layer w0.55: C70.2 45.58,25.18 v1(36.48,25.18) ; D34.2 31.36,33.39 30.24,32.26 30.24,28.76 32.48,26.52 ; R164.2 v1(28.21,23.33) ; v2(51.76,23.12) 52.07,22.8 55.29,22.8 56.18,21.91 56.18,18.04 NOREF#8.1 ; v1(31.56,21.07) 31.56,21.75 ; 32.48,26.52 35.13,26.52 v1(36.48,25.18) ; 32.48,26.52 v2(31.03,26.52) ; Q13.3 60.26,8.8 v2(57.69,8.8) ; v1(36.48,25.18) C161.2 ; C158.2 v1(26.59,26.13) ; R42.1 v1(52.59,23.94)
  Top Layer w0.6: 55.05,13.02 55.05,12.93 v2(55.52,12.45) 55.52,8.81 v2(55.51,8.8)
  Top Layer w0.8: R161.2 v1(43.95,10.6)
  Inner2 w0.249: v2(51.76,23.12) v1(52.59,23.94)
  Inner2 w0.25: 31.56,21.8 30.03,23.33 v1(28.21,23.33) ; 31.56,21.8 v1(31.56,21.07) ; 31.56,21.8 33.1,21.8 ; H1.1 38.39,19.62 35.29,19.62 33.1,21.8 ; v2(48.89,15.03) 51.47,12.45 v2(55.52,12.45) ; 33.1,21.8 v1(36.48,25.18)
  Inner2 w0.55: v2(31.03,26.52) 30.02,26.52 28.82,25.31 27.4,25.31 v1(26.59,26.13) ; 46.67,30.02 49.33,30.02 v1(49.99,30.68) ; 46.67,30.02 45.43,30.02 44.8,29.39 v1(44.8,25.8) 49.08,25.8 v2(51.76,23.12) ; 46.67,30.02 v1(48.25,31.6) ; v2(55.52,10.98) 53.29,10.98 52.4,11.88 47.73,11.88 46.45,10.6 v1(43.95,10.6) ; v2(55.51,8.8) v2(57.69,8.8)
VCCSYS+5V: length 65.9
  Top Layer w0.25: Q1.2 51.01,10.35 R14.2 50.5,9.69 49.26,8.45 v2(49.09,8.45)
  Top Layer w0.55: 58.72,11.42 v1(58.04,11.42)
  Top Layer w0.8: v2(49.75,3.5) 50.93,3.5 R148.1 ; R146.1 v1(33.76,18.65) 33.76,19.09 32.99,19.86 29.28,19.86 D33.2
  Top Layer w1.2: D33.2 27.64,21.13 Q11.2
  Inner2 w0.6: 43.07,7.81 44.92,9.66 47.5,9.66 48.88,11.04 52.05,11.04 53.1,9.99 55.73,9.99 57.15,11.42 v1(58.04,11.42) ; 43.07,7.81 46.94,7.81 ; 43.07,7.81 36.13,7.81 32.53,11.42 32.53,17.42 v1(33.76,18.65) ; 46.94,7.81 48.45,7.81 v2(49.09,8.45) ; 46.94,7.81 48.44,6.31 48.44,4.82 v2(49.75,3.5)
VCCTYPEC: length 16
  Top Layer w0.55: USB1.11 v1(31.86,8.39) ; USB1.2 v1(27.06,8.39)
  Top Layer w0.8: C74.2 v1(29.04,10.31) D17.2 27.1,11.69 26.07,10.66 R147.1
  Inner1 w0.8: 30.96,8.39 v1(27.06,8.39) ; 30.96,8.39 v1(29.04,10.31) ; 30.96,8.39 v1(31.86,8.39)
VCCUSB: length 54.1
  Top Layer w0.249: U2.4 20.28,9.19 19.44,8.35 R3.2 ; LED1.2 LED2.2 2.26,2.79 3.49,2.79 4.22,3.51 4.22,4.93 14.78,15.49 14.78,16.82 15.48,17.52 v1(16.47,17.52) U2.8
  Inner2 w0.249: v1(16.47,17.52) 15.2,16.25 15.2,11.32 16.52,10 v1(21.09,10)
  Inner2 w1.2: v1(27.32,15.03) v1(26.56,15.03) 26.56,13.33 25.06,11.83 22.16,11.83 v1(21.09,10.76) v1(21.09,10)
BATALT: length 25.1
  Top Layer w0.1: U48.A1 v2(29.32,32.75)
  Top Layer w0.5: v2(34.92,18.56) 34.92,18.56 R181.1
  Inner2 w0.25: v2(34.92,18.56) 33.74,19.74 29.24,19.74 26.94,22.04 26.94,22.66 24.91,24.7 24.91,28.77 27.1,30.97 27.1,31.37 28.48,32.75 v2(29.32,32.75)
BATTERYMCUADC: length 19.5
  Top Layer w0.25: v2(35.76,30.25) 36.44,29.57 37.89,29.57 38.29,29.97 39.86,29.97 v2(40.31,29.53)
  Top Layer w0.254: v1(45.12,31.45) 45.38,31.45 45.6,31.22 45.6,30.93 U16.8
  Inner2 w0.25: v2(35.76,30.25) 34.91,31.11 32.28,31.11 30.37,33.01 v1(30.37,33.95) ; v2(40.31,29.53) 40.31,30.15 41.61,31.45 v1(45.12,31.45)
BGND: length 10.3
  Top Layer w0.25: U46.6 36.21,13.29 ; v1(36.52,13.63) U46.7
  Top Layer w0.5: v1(35.81,16.27) 35.8,16.26 R129.2
  Top Layer w0.6: v1(40.4,9.32) 41.07,9.32 R160.1
  Top Layer w0.8: 38.46,10.65 v1(37.6,10.65) ; R60.2 v1(31.72,16.29) ; v1(36.52,13.63) 36.52,13.54 v1(35.24,12.27) 35.24,12.27 C150.1
  Inner1 w0.6: v1(40.4,9.32) 38.92,9.32 v1(37.6,10.65)
  vias: v1(33.41,14.27) v1(36.02,17.99) v1(36.52,14.26)
BOOSTEN: length 31.3
  Top Layer w0.254: 59.59,10.53 67.88,10.53 70.68,7.73 74.04,7.73 77.1,4.67 82.18,4.67 83.05,5.54 83.05,7.56 84.08,8.58 Q14.1
BUCK+3V3: length 16.4
  Top Layer w0.25: v1(36.89,17.06) 37.47,16.48 R128.1
  Inner2 w0.25: v1(40.72,10.59) 38.56,8.44 36.47,8.44 34.5,10.4 34.5,13.05 35.28,13.83 35.28,14.67 36.89,16.28 v1(36.89,17.06)
LCLK: length 36.2
  Top Layer w0.249: U16.13 43.09,28.2 v1(42.67,28.63)
  Top Layer w0.55: 58.72,13.2 v1(58.04,13.2)
  Inner2 w0.254: v1(58.04,13.2) 57.47,13.2 57.03,13.63 52,13.63 49.21,16.43 49.21,18.17 47.15,20.23 44.52,20.23 42.25,22.51 42.25,23.86 39.27,26.84 39.27,27.93 40.24,28.9 40.88,28.9 41.88,29.9 42.64,29.9 43.03,29.51 43.03,28.99 v1(42.67,28.63)
LDQ: length 31.6
  Top Layer w0.249: U16.12 43.49,28.7 42.93,29.26 42.15,29.26 v1(42.15,29.26)
  Top Layer w0.55: 58.72,14.09 v1(58.05,14.09)
  Inner2 w0.254: v1(42.15,29.26) 40.62,27.74 40.62,26.13 42.7,24.05 42.7,22.69 44.71,20.68 47.34,20.68 49.66,18.36 49.66,16.62 52.19,14.09 v1(58.05,14.09)
LLOCK: length 35.5
  Top Layer w0.254: v1(38.61,26.26) 38.61,27.21 39.53,28.14 42.16,28.14 42.6,27.7 U16.14
  Top Layer w0.55: 58.72,12.31 v1(58.04,12.31)
  Inner2 w0.254: v1(38.61,26.26) 39.16,26.26 41.79,23.63 41.79,22.32 44.34,19.77 46.96,19.77 48.75,17.98 48.75,16.24 51.81,13.18 56.51,13.18 57.38,12.31 v1(58.04,12.31)
LOOFF: length 2.6
  Top Layer w0.35: R186.1 49.3,18.4 50.79,19.89 Q16.3
LPGND: length 194.1
  Top Layer w0.55: J1.8 98.06,29.19 96.27,30.98 96.27,35.65 93.22,38.7 88.25,38.7 NOREF#3.1
  Top Layer w0.8: R151.1 v1(53.31,7.16)
  Top Layer w1: NOREF#3.1 88.45,37.37 R152.2
  Top Layer w1.4: CN2.2 86.92,37.37 NOREF#3.1
  Inner1 w0.55: 53.31,5.94 58.47,0.78 95.49,0.78 96.84,2.12 96.84,19.98 J1.5 ; 53.31,5.94 v1(53.31,7.16) ; 53.31,5.94 48.15,0.78 5.57,0.78 4.07,2.28 4.07,19.03 J2.5
  Inner1 w1: J1.5 J1.6 J1.7 J1.8 ; J2.5 J2.6 J2.7 J2.8 6.76,29.19 13.14,35.57 NOREF#4.1
POWER3V3EN: length 44.2
  Top Layer w0.25: D2.1 52.55,11.74 R16.2 51.64,10.81 51.64,9.32 51.21,8.89 50.46,8.89 v2(47.59,6.02) ; D2.1 52.26,12.78 50.06,12.78 Q1.3 ; D2.1 52.55,14.02 51.43,15.14 49.77,15.14 49.3,15.61 R186.2 ; v1(34.55,8.26) 34.55,10.54 v2(33.87,11.22) ; U46.4 34.83,15.29 v1(34.83,15.9) 34.83,16.95 R181.2
  Inner2 w0.25: v1(34.55,8.26) 35.62,7.19 46.43,7.19 v2(47.59,6.02) ; v1(34.83,15.9) 34.83,14.01 33.87,13.06 v2(33.87,11.22)
POWERLLEN: length 42.6
  Top Layer w0.249: 58.72,10.53 57.98,10.53 57.39,11.12 v1(57.39,14.9) ; R174.1 58.72,10.01 59,9.73 60.85,9.73 61.77,8.82 61.77,7.86 Q13.1
  Top Layer w0.25: v1(47.96,22.62) 46.87,21.53 44.39,21.53 42.43,23.48 H1.2
  Top Layer w0.254: U16.16 44.19,26.7 v1(43.89,26.4)
  Inner2 w0.249: 49.08,22.01 51.34,19.75 52.68,19.75 53.57,18.86 53.57,18.34 54.19,17.72 55.26,17.72 57.39,15.59 v1(57.39,14.9)
  Inner2 w0.25: v1(43.89,26.4) 43.89,25.43 44.86,24.46 44.86,22.85 45.68,22.03 49.06,22.03 49.08,22.01 ; v1(47.96,22.62) 47.96,22.03
POWERMCUCTLR: length 26.5
  Top Layer w0.25: D2.2 53.33,14.63 53.33,13.79 54.1,13.02 54.18,13.02 C75.2
  Top Layer w0.254: v1(44.56,30.7) 44.56,30.53 U16.9
  Top Layer w0.6: D2.2 52.13,15.82 v1(51.82,15.82)
  Inner2 w0.25: v1(51.82,15.82) 51.82,16.39 50.56,17.65 50.56,18.73 47.71,21.58 45.49,21.58 44.41,22.66 44.41,24.27 43.08,25.61 43.08,27.39 43.94,28.25 43.94,29.37 44.56,30 v1(44.56,30.7)
POWERMCUKEY: length 23.8
  Top Layer w0.254: v1(43.89,30.22) 43.89,30.22 44.42,29.7 U16.10
  Top Layer w0.55: R187.2 50.21,16.25 ; 50.21,16.25 v1(50.56,16.61) 51.71,16.61 ; 50.21,16.25 Q2.3
  Inner2 w0.25: v1(50.56,16.61) 50.11,17.06 50.11,18.54 47.53,21.13 44.9,21.13 43.15,22.88 43.15,24.26 41.82,25.6 41.82,26.76 43.49,28.44 43.49,29.82 v1(43.89,30.22)
REST: length 21.6
  Top Layer w0.249: R191.1 42.88,32.73 43.58,33.42 ; 42.24,34.02 R149.2 40.96,34.29 v1(39.87,34.29) ; 43.58,33.42 42.99,34.01 C56.2 ; 43.58,33.42 44.05,33.42 46.12,31.36 U16.7
  Inner2 w0.25: v1(39.87,34.29) 39.5,33.92 39.5,32.55 37.97,31.03 37.97,24.29 H2.2
SCL: length 42.9
  Top Layer w0.249: U48.A3 28.53,31.37 v2(28.53,30.35)
  Top Layer w0.25: v2(25.57,27.8) 25.57,26.12 26.19,25.5 26.54,25.5 27.57,24.47 28.46,24.47 ; v2(38.62,28.12) 37.81,27.31 v2(37.34,27.31) ; 28.46,24.47 27.85,25.08 S1.6 ; 28.46,24.47 30.39,24.47 v2(30.94,25.02) 31.9,25.02 31.9,24.88 32.35,24.43 32.77,24.43 33.08,24.12 U23.2
  Top Layer w0.254: U16.4 47.62,31.84 46.43,33.02 v1(46.43,34.44)
  Inner2 w0.25: v2(30.94,25.02) 33.22,25.02 35.51,27.31 v2(37.34,27.31) ; v2(38.62,28.12) 39.46,28.96 39.46,30.03 42.07,32.64 45.71,32.64 46.43,33.37 v1(46.43,34.44) ; v2(25.57,27.8) 26.71,27.8 28.53,29.62 v2(28.53,30.35)
SDA: length 43.5
  Top Layer w0.1: U48.A2 28.17,32.25 29.32,31.1 v2(29.32,31)
  Top Layer w0.25: v2(37.3,28.91) 38.5,28.91 v2(38.61,29.01) ; 31.13,23.25 29.84,23.25 R164.1 29.75,23.48 29.27,23.96 27.19,23.96 v2(26.44,24.71) ; 31.13,23.25 32.55,23.25 ; 31.13,23.25 v2(30.71,23.67) ; v2(29.85,25.1) S1.1 ; v1(45.63,33.83) 45.63,33.12 47.12,31.63 U16.5
  Inner2 w0.25: v2(30.71,23.67) 30.71,24.24 v2(29.85,25.1) 30.4,25.65 33.22,25.65 36.47,28.91 v2(37.3,28.91) ; v2(38.61,29.01) 38.61,29.81 41.89,33.09 44.9,33.09 v1(45.63,33.83) ; v2(26.44,24.71) 25.9,25.25 25.9,26.63 26.6,27.32 27.48,27.32 29.32,29.16 v2(29.32,31)
USBDN: length 40.7
  Top Layer w0.25: USB1.7 29.71,8.16 29.5,8.37 28.93,8.37 28.71,8.16 USB1.5 28.71,6.68 v1(29.41,5.97)
  Top Layer w0.35: R41.1 49.83,22.86 50.05,22.65 50.05,21.62 47.41,18.98 47.41,9.83 45.07,7.48 38.28,7.48 37.93,7.83 36.26,7.83 35.57,7.15 D16.2
  Top Layer w0.55: v1(35.57,6.04) D16.2
  Inner2 w0.35: v1(29.41,5.97) 30.06,5.32 34.85,5.32 v1(35.57,6.04)
USBDP: length 38.2
  Top Layer w0.25: USB1.6 29.21,6.84 29.43,6.62 30.21,6.62 USB1.8
  Top Layer w0.35: 30.21,6.62 31.51,5.32 35.83,5.32 37.06,6.55 37.56,6.55 ; R40.1 50.85,22.84 50.6,22.59 50.6,21.31 47.96,18.67 47.96,9.6 45.24,6.89 D16.1 37.44,6.92
$5N13: length 6.7
  Top Layer w0.25: U5.7 84.08,14.9 85.3,13.67 86.66,13.67 R19.2
$5N17: length 1.6
  Top Layer w0.254: 88.59,14.8 88.5,14.9 U5.2
$5N18: length 1.5
  Top Layer w0.254: R21.2 88.59,13.84 88.59,13.94
$5N72: length 24
  Top Layer w0.254: v1(84.18,11.29) 80.08,11.29 v1(79.48,11.89)
  Top Layer w0.55: 89.61,13.94 v1(90.34,13.94)
  Inner2 w0.25: v1(84.18,11.29) 85.67,11.29 86.49,12.1 86.49,13.58 87.46,14.54 89.74,14.54 v1(90.34,13.94)
  Inner2 w0.254: v1(79.48,11.89) 75.25,16.12 v1(71.5,16.12)
$5N126: length 19.7
  Top Layer w0.254: R23.1 93.84,26.81 94.9,25.75 94.9,17.88 91.82,14.8 R25.1 ; U5.3 88.31,15.55 R24.2 88.75,15.81 89.73,14.83
$5N134: length 5.8
  Top Layer w0.8: D29.1 77.01,32.13 C19.2 ; C25.1 79.45,32.13 D25.2
  Top Layer w1.3: C19.2 C25.1
$5N135: length 3.7
  Top Layer w0.8: C20.2 74.88,26.78 D22.1 D29.2
$5N138: length 3.7
  Top Layer w0.8: D28.2 D23.1 88.59,26.78 C22.2
$5N139: length 5.8
  Top Layer w0.8: D23.2 88.59,32.13 C21.1 ; D27.1 86.15,32.13 C23.2
  Top Layer w1.3: C23.2 C21.1
$5N140: length 3.7
  Top Layer w0.8: D27.2 D24.1 84.02,26.78 C24.2
$5N141: length 5.8
  Top Layer w0.8: D24.2 84.02,32.13 C23.1 ; D26.1 81.58,32.13 C25.2
  Top Layer w1.3: C25.2 C23.1
$5N142: length 3.7
  Top Layer w0.8: C26.2 79.45,26.78 D25.1 D26.2
$5N1401: length 2.9
  Top Layer w0.5: R29.1 R19.1
  Top Layer w0.55: Q15.3 88.31,9.94 R19.1
$5N6511: length 18
  Top Layer w0.8: D22.2 74.88,32.13 C19.1
  Top Layer w1.3: C17.2 62.13,28.95 65.38,32.2 C19.1
$5N17165: length 13
  Top Layer w0.25: U5.1 87.04,14.19 v1(87.58,13.65)
  Top Layer w0.254: v1(82.33,8.28) 80.07,8.28 R63.2
  Inner2 w0.25: v1(87.58,13.65) 87.58,12.23 83.63,8.28 v1(82.33,8.28)
$5N31990: length 46
  Top Layer w0.254: 59.59,12.31 66.75,12.31 70.87,8.19 74.23,8.19 77.11,5.3 v2(80.83,5.3)
  Inner2 w0.254: J1.1 96.34,13.5 94.23,13.5 86.03,5.3 v2(80.83,5.3)
$5N31997: length 45.1
  Top Layer w0.254: 59.59,13.2 66.5,13.2 71.06,8.64 74.42,8.64 77.08,5.98 v2(81.64,5.98)
  Inner2 w0.254: J1.2 94.04,13.95 86.07,5.98 v2(81.64,5.98)
$5N32004: length 46
  Top Layer w0.254: v2(80.83,6.69) 77.01,6.69 74.61,9.09 71.25,9.09 66.25,14.09 59.59,14.09
  Inner2 w0.254: J1.3 96.41,14.47 93.92,14.47 86.14,6.69 v2(80.83,6.69)
$5N44028: length 3.2
  Top Layer w0.55: 86.11,7.47 86.73,8.08 86.73,9.38 Q14.2
$7N6323: length 1.4
  Top Layer w0.28: U16.1 L15.2
$7N6352: length 4.1
  Top Layer w0.249: U16.26 50.27,27.2 50.85,26.62 50.85,24.81
  Top Layer w0.25: 51.86,24.81 50.85,24.81
$7N6426: length 4.4
  Top Layer w0.25: U16.29 50.52,28.7 51.29,29.47 52.7,29.47 53.45,28.72 X4.1
$7N6435: length 2.7
  Top Layer w0.249: U16.25 50.12,26.7 50.35,26.48 50.35,26.26 49.58,25.49 49.58,25.06 49.83,24.81
$7N6440: length 4.3
  Top Layer w0.25: U16.6 46.62,31.5 44.83,33.28 v1(44.83,34.5)
$7N6501: length 7
  Top Layer w0.249: NOREF#7.1 53.11,25.64 52.44,25.64 51.93,26.15 51.93,26.81 50.54,28.2 U16.28
$7N6504: length 9.2
  Top Layer w0.249: v1(51.48,25.71) 51.48,26.62 50.4,27.7 U16.27
  Inner2 w0.249: v1(51.48,25.71) 52.62,25.71 53.37,24.96 53.37,22.88 NOREF.1
$7N6986: length 48.7
  Top Layer w0.25: U16.15 41.84,27.2 ; 41.84,27.2 41.84,27.2 41.84,26.26 42.45,26.26 ; 41.84,27.2 C73.2 ; v1(48.78,23.36) 47.65,23.36 46.54,22.24 45.12,22.24 v1(43.78,23.58)
  Top Layer w0.254: v2(56.6,17.27) 56.6,8.77 58.34,7.03 63.49,7.03 64.96,5.55 64.96,4.04 66.7,2.3 KEY5.2
  Inner2 w0.249: v1(48.78,23.36) 51.82,20.31 55.38,20.31 56.6,19.09 v2(56.6,17.27)
  Inner2 w0.25: v1(43.78,23.58) 43.78,24.27 42.45,25.6 v1(42.45,26.26)
$7N24444: length 1.9
  Top Layer w0.54: U22.2 C83.1 L15.1
$7N25625: length 1.6
  Top Layer w0.54: RF2.1 51.79,34.17 C83.2
$7N28063: length 10.8
  Top Layer w0.7: Q12.1 v2(21.4,28.46)
  Top Layer w1.2: R182.1 20.87,22.67 19.25,24.29 17.35,24.29 D1.1
  Inner2 w0.7: v2(17.59,27.74) 18.32,28.46 v2(21.4,28.46)
$7N28074: length 2.6
  Top Layer w0.249: 16.47,10.54 R3.1 15.2,9.21
$7N28076: length 24.7
  Top Layer w0.249: v1(15.04,18.86) 15.04,18.35 13.77,17.09 13.77,15.75 LED1.1
  Top Layer w0.55: 19.13,18.77 v1(19.76,18.77)
  Inner2 w0.249: v1(19.76,18.77) 19.18,18.19 15.7,18.19 v1(15.04,18.86)
$7N28077: length 1.6
  Top Layer w0.249: R6.2 17.61,16.49 U2.7
$7N28078: length 1.6
  Top Layer w0.249: U2.6 19.13,16.48 R5.2
$7N28080: length 1.4
  Top Layer w0.249: U2.2 17.91,10.36 R7.2
$7N28081: length 22.1
  Top Layer w0.249: LED2.1 3.77,4.32 3.77,5.11 14.33,15.68 14.33,17.01 16.07,18.75 R6.1
$7N28100: length 1.8
  Top Layer w0.254: USB1.4 28.21,9.13 R2.2
$7N28101: length 1.8
  Top Layer w0.254: USB1.10 31.21,9.08 31.34,9.2
$7N28121: length 23.7
  Top Layer w0.7: FPC1.1 20.13,29.42 C1.2 20.56,27.32 Q12.2 22.02,27.17 D1.2
  Inner2 w1.2: v2(6.86,31.71) 13.11,25.45 19.84,25.45 v2(20.98,26.6)
$7N28604: length 19.1
  Top Layer w0.25: Q2.1 48.98,13.77 48.98,9.39 45.64,6.05 44.63,6.05 40.88,2.3 ; R14.1 49.11,9.84 Q1.1
  Top Layer w0.6: 40.88,2.3 40.88,2.29 42.68,2.29
$7N34810: length 0.7
  Top Layer w0.25: 50.5,29.42 50.27,29.2 U16.30
$7N34817: length 2.8
  Top Layer w0.25: 50.84,29.77 51.04,29.96 51.5,29.96 X4.3 52.28,30.75 C71.2
$7N35253: length 1.8
  Top Layer w0.25: R129.1 37.47,15.6 R128.2 37.52,15.55 U46.3
$7N36990: length 1.9
  Top Layer w0.25: 32.55,22.75 32.4,22.6 R171.2 R172.1
$7N37153: length 2.1
  Top Layer w0.25: U23.6 33.1,22.44 33.1,22.18 33.44,21.84 R169.2 34.36,21.47 R170.1
$7N48528: length 0.9
  Top Layer w0.249: U48.B3 27.65,30.81
$7N48606: length 1.1
  Top Layer w0.1: U48.B1 27.65,33.08 28.13,33.57 28.13,33.63
$7N49212: length 3.9
  Top Layer w0.35: Q16.1 51.64,18.94 50.92,18.22
  Top Layer w0.55: R187.1 50.92,18.22 51.45,17.69
$7N49691: length 27.8
  Top Layer w0.249: R184.1 26.12,30.72 U48.C3 ; v2(26.5,33.29) 27.04,32.75 U48.C1
  Top Layer w0.25: Q12.3 24.46,22.79 21.11,19.44 16.53,19.44 R178.1
  Top Layer w0.55: C169.2 27.91,34.72 v2(27.92,34.71)
  Top Layer w1.2: R184.1 24.46,29.19 Q12.3
  Inner2 w0.55: v2(27.92,34.71) 27.09,34.71 26.5,34.12 v2(26.5,33.29) 26.5,31.26 v2(25.33,30.09)
$7N49697: length 1.9
  Top Layer w0.249: 16.13,20.94 15.29,20.94 C165.2 15.19,20.81 15.19,19.92
$7N60752: length 1.2
  Top Layer w0.55: R190.1 34.93,33.39 D34.1
$7N60914: length 15.7
  Top Layer w0.249: 41.4,30.42 41.93,29.89 42.94,29.89 43.63,29.2 U16.11 ; 41.4,30.42 42.27,31.29 ; 41.4,30.42 36.6,30.42 35.6,31.42 U17.1
  Top Layer w0.55: R190.2 35.8,32 U17.1 36.28,31.12 C61.2
$7N60996: length 1.4
  Top Layer w0.55: D35.1 40.88,32.79 R149.1

## Copper pours and planes (outline as drawn; the poured copper is in the pictures)
DGND on Top Layer: 44.72,23.95 46.21,23.95 46.21,22.78 44.72,22.78
DGND on Top Layer: 25.04,29.06 29.79,29.06 29.79,35.63 55.02,35.63 55.02,18.45 32.05,18.45 25.04,25.46
DGND on Top Layer: 33.96,23.39 35.09,23.39 35.09,22.34 33.96,22.34
DGND on Inner1: 25.03,29.06 29.79,29.06 29.79,35.63 55.02,35.63 55.02,18.45 32.05,18.45 25.03,25.47
DGND on Inner1: 24.24,17.1 29.33,17.1 33.68,12.75 33.68,1.26 24.95,1.26 24.95,8.15 24.24,8.87
DGND on Inner1: 27.06,8.16 38.39,8.16 38.39,1.46 27.06,1.46
DGND on Inner2: 25.03,29.06 29.79,29.06 29.79,35.63 55.02,35.63 55.02,18.45 32.05,18.45 25.03,25.47
GNDBADC on Inner1: 25.13,35.63 29.79,35.63 29.79,29.06 25.13,29.06
GNDBADC on Inner2: 25.13,35.63 29.79,35.63 29.79,29.06 25.13,29.06
GNDBAT on Top Layer: 17.75,22.38 19.79,22.38 19.79,20.67 17.75,20.67
GNDBAT on Top Layer: 19.31,15.4 24.35,15.4 24.35,11.53 19.31,11.53
GNDBAT on Top Layer: 14.42,6.05 19.43,6.05 31.93,18.56 28.96,21.53 14.42,21.53
GNDBAT on Inner1: 14.27,6.05 19.43,6.05 31.93,18.56 25.04,25.46 25.04,33.97 15.64,33.97 14.27,32.59
GNDBAT on Inner2: 14.27,6.05 19.43,6.05 31.93,18.56 25.04,25.46 25.04,33.99 15.52,33.99 14.27,32.74
GNDBAT_EXT on Top Layer: 18.58,33.3 23.5,33.3 23.5,30.61 18.58,30.61
GNDBAT_EXT on Top Layer: 9.63,33.3 19.2,33.3 19.2,28.82 9.63,28.82
PGND on Top Layer: 86.01,17.52 87.84,17.52 87.84,16.2 86.01,16.2
PGND on Top Layer: 72.11,13.8 75.65,13.8 75.65,10.16 72.11,10.16
PGND on Top Layer: 88.94,19.45 91.09,19.45 91.09,17.24 88.94,17.24
PGND on Top Layer: 85.82,19.45 89.86,19.45 89.86,17.24 85.82,17.24
PGND on Inner1: 75.85,6.55 86.65,6.55 93.62,13.52 93.62,21.15 91.77,23 71.58,23 70.79,22.22 70.79,11.61
VCCBAT+4V2 on Top Layer: 19.97,17.08 22.56,17.08 22.56,15.77 19.97,15.77
VCCBOOST+5V on Top Layer: 84.61,22.52 90.68,22.52 90.68,19.87 84.61,19.87
VCCBOOSTCTR+5V on Top Layer: 82.03,14.26 84.88,14.26 84.88,13.1 82.03,13.1
VCCBOOSTCTR+5V on Top Layer: 82.04,14.25 83.46,14.25 83.46,12.95 82.04,12.95
VCCBUCK on Top Layer: 33.94,14.11 35.75,14.11 35.75,13.28 33.94,13.28
VCCMCU+3V3 on Top Layer: 49.52,31.06 50.89,31.06 50.89,29.56 49.52,29.56
VCCMCU+3V3 on Top Layer: 47.98,32.2 48.75,32.2 48.75,30.6 47.98,30.6
VCCMCU+3V3 on Top Layer: 44.59,26.3 46.26,26.3 46.26,24.51 44.59,24.51
VCCUSB on Top Layer: 25.04,17.52 28.46,17.52 28.46,14.68 25.04,14.68
VCCUSB on Top Layer: 19.87,11.16 23.89,11.16 23.89,9.58 19.87,9.58
BGND on Inner1: 29.96,16.68 33.05,13.59 33.05,9.79 35.25,7.59 42.56,7.59 46.85,11.88 46.85,16.78 44.16,19.47 32.75,19.47
BUCK+3V3 on Top Layer: 39.45,16.9 45.75,16.9 45.75,10.18 39.45,10.18
$5N14 on Top Layer: 81.12,15.94 83.03,15.94 83.03,15.13 81.12,15.13
$5N72 on Top Layer: 74.42,20.11 76.04,20.11 76.04,16.89 74.42,16.89
$5N72 on Top Layer: 64.87,17.11 76.3,17.11 76.3,15.49 64.87,15.49
$5N128 on Top Layer: 65.68,20.87 73.15,20.87 73.15,18.59 65.68,18.59
